# Altium project Capacitive sensor board.PrjPcb
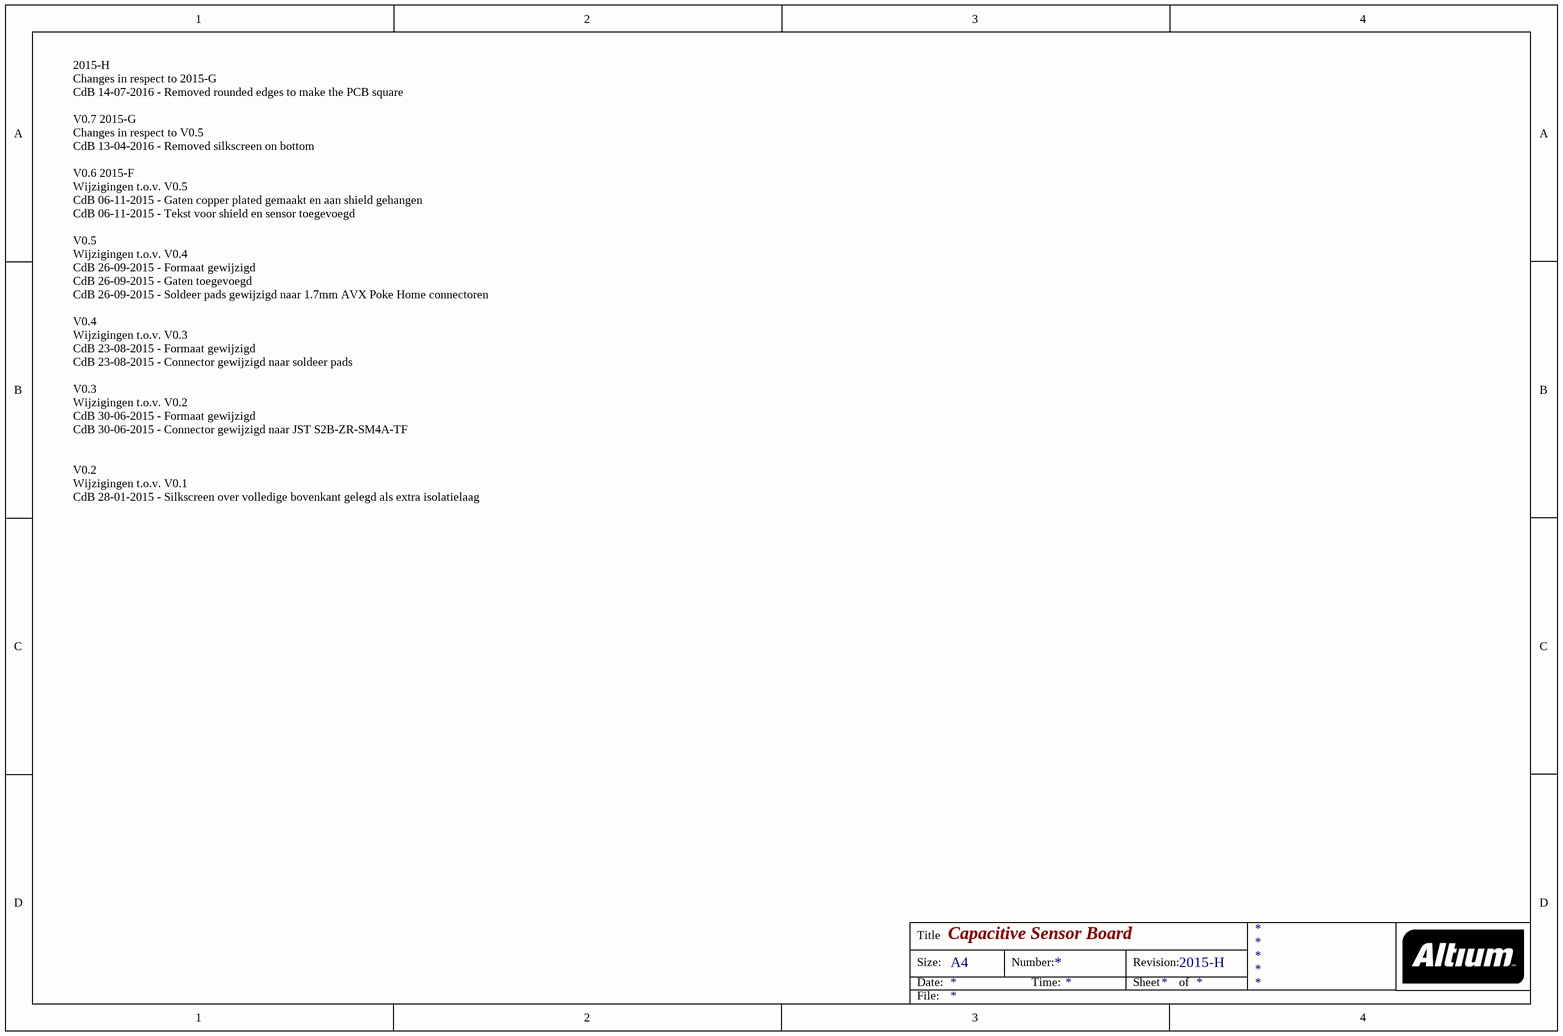
[diagram p0: Revisions.SchDoc]
2 sheets, 2 parts. Net scope: global (net labels, ports and power ports of the same name join across sheets).
Board file: Capacitive sensor board.PcbDoc
Sheets:
  Revisions.SchDoc
  Sheet1.SchDoc

## Sheet Revisions.SchDoc: Capacitive Sensor Board
size A4; DrawnBy: Coen de Boer; Engineer: Coen de Boer; Revision: 2015-H

### Notes on the sheet
- 2015-H
  Changes in respect to 2015-G
  CdB 14-07-2016 - Removed rounded edges to make the PCB square
  V0.7 2015-G
  Changes in respect to V0.5
  CdB 13-04-2016 - Removed silkscreen on bottom
  V0.6 2015-F
  Wijzigingen t.o.v. V0.5
  CdB 06-11-2015 - Gaten copper plated gemaakt en aan shield gehangen
  CdB 06-11-2015 - Tekst voor shield en sensor toegevoegd
  V0.5
  Wijzigingen t.o.v. V0.4
  CdB 26-09-2015 - Formaat gewijzigd
  CdB 26-09-2015 - Gaten toegevoegd
  CdB 26-09-2015 - Soldeer pads gewijzigd naar 1.7mm AVX Poke Home connectoren
  V0.4
  Wijzigingen t.o.v. V0.3
  CdB 23-08-2015 - Formaat gewijzigd
  CdB 23-08-2015 - Connector gewijzigd naar soldeer pads
  V0.3
  Wijzigingen t.o.v. V0.2
  CdB 30-06-2015 - Formaat gewijzigd
  CdB 30-06-2015 - Connector gewijzigd naar JST S2B-ZR-SM4A-TF
  V0.2
  Wijzigingen t.o.v. V0.1
  CdB 28-01-2015 - Silkscreen over volledige bovenkant gelegd als extra isolatielaag
- Title
- Size:
- Date:
- A4
- Number:
- Time:
- Revision:
- Sheet
- of
- File:

## Sheet Sheet1.SchDoc: Capacitive Sensor Board
size A4; DrawnBy: Coen de Boer; Engineer: Coen de Boer; Revision: 2015-H
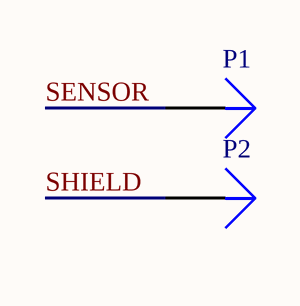
[diagram p1: Sheet1.SchDoc]

### Parts
P1  (no value)  [AVX POKE HOME CONTACT 1.7MM]
P2  (no value)  [AVX POKE HOME CONTACT 1.7MM]

### Nets
SENSOR: P1.1
SHIELD: P2.1

### Notes on the sheet
- Title
- Size:
- Date:
- A4
- Number:
- Time:
- Revision:
- Sheet
- of
- File:

### Library data of the parts
P1 P2 = Plug: Mfg: AVX; Mfg code: 70-9296-001-017-006; LatestRevisionDate: 17-Jul-2002; LatestRevisionNote: Re-released for DXP Platform.; Publisher: Altium Limited